# EAGLE schematic AVR_Tag-Connect (EAGLE 7.4.0)
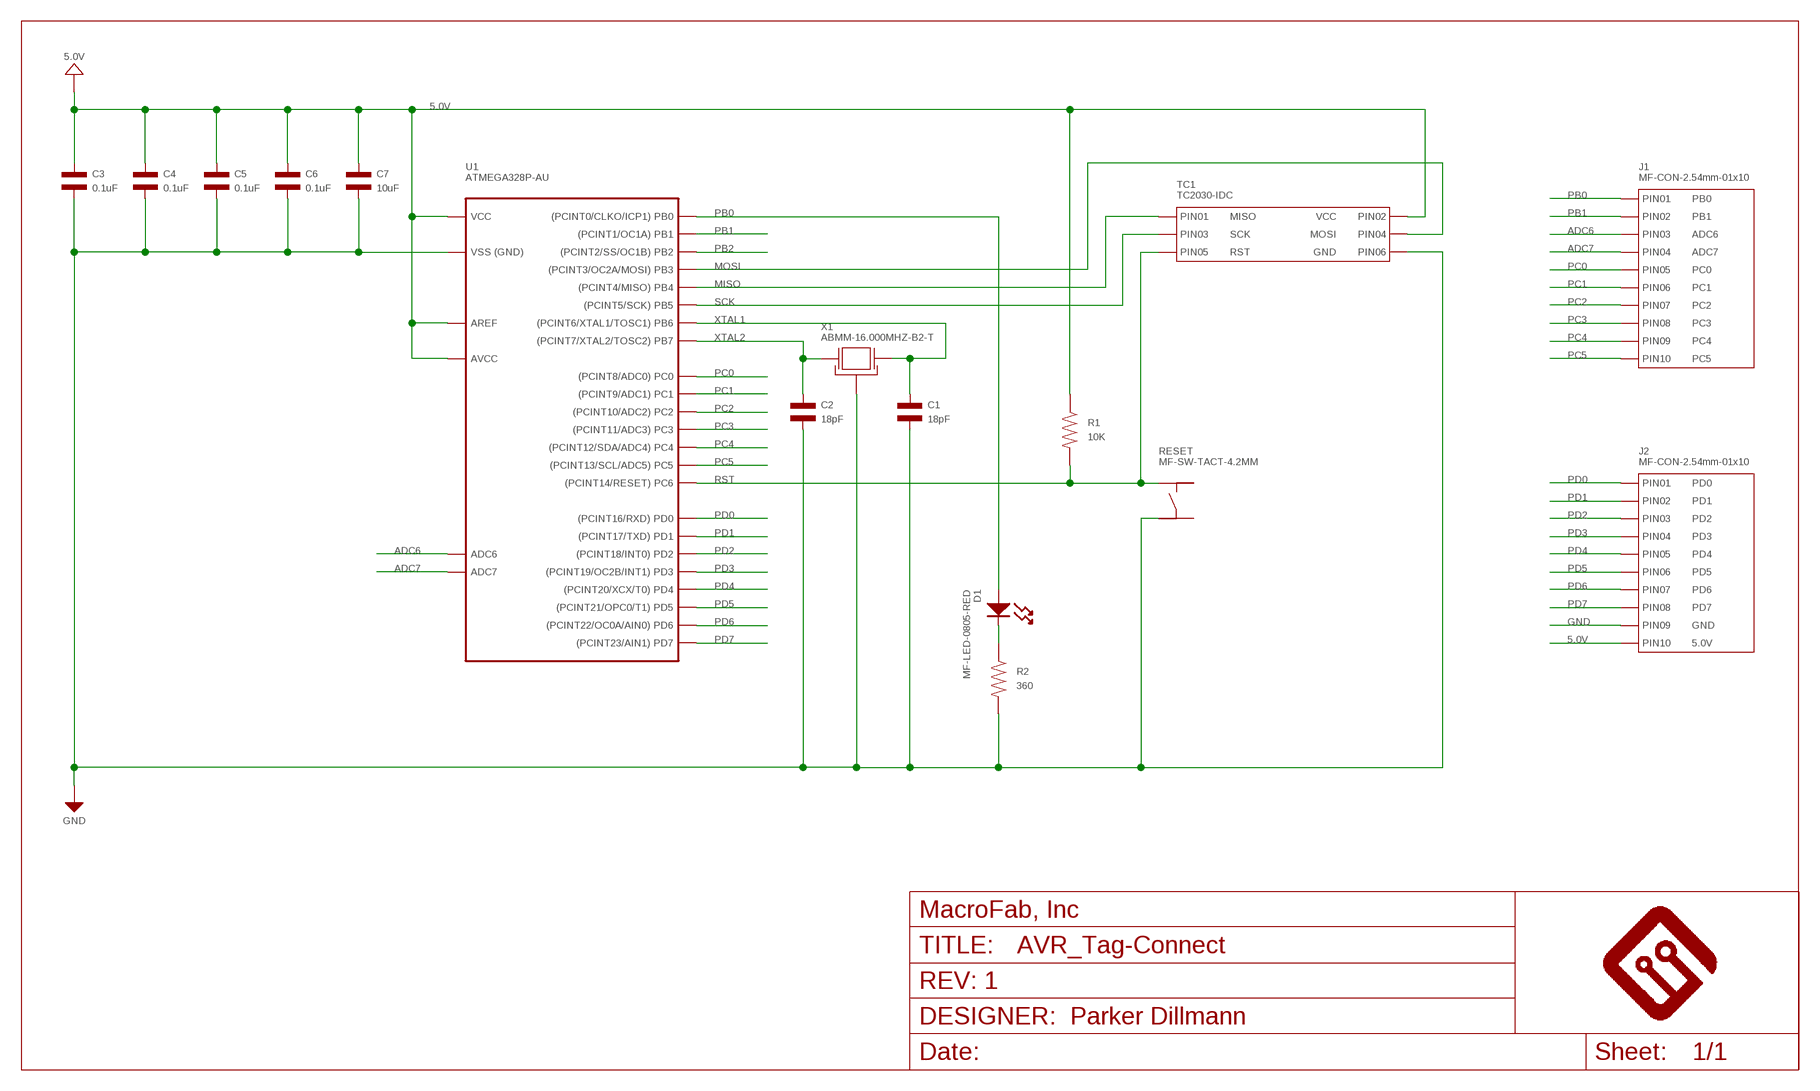
[diagram p0: schematic, sheet 1]

## Parts
C1  18pF  CAPACITOR_NP_0805  [C0805]
C2  18pF  CAPACITOR_NP_0805  [C0805]
C3  0.1uF  CAPACITOR_NP_0805  [C0805]
C4  0.1uF  CAPACITOR_NP_0805  [C0805]
C5  0.1uF  CAPACITOR_NP_0805  [C0805]
C6  0.1uF  CAPACITOR_NP_0805  [C0805]
C7  10uF  CAPACITOR_NP_1206  [C1206]
D1  MF-LED-0805-RED  LED_SINGLE-0805-RED  [LED0805]
FRAME1  MF_FRAMEDEFAULT  [MF_FRAME_DEFAULT]
J1  MF-CON-2.54mm-01x10  CON_01X10_PTH_2.54MM  [PTH_2.54MM_01X10]
J2  MF-CON-2.54mm-01x10  CON_01X10_PTH_2.54MM  [PTH_2.54MM_01X10]
R1  10K  RESISTOR_0805  [R0805]
R2  360  RESISTOR_0805  [R0805]
RESET  MF-SW-TACT-4.2MM  TACT_4.2MM  [TACT4.2MM]
TC1  TC2030-IDC  CON_02X03_AVRISP_TC2030-IDC  [TC2030-IDC-FP]
U1  ATMEGA328P-AU  [TQFP32]
X1  ABMM-16.000MHZ-B2-T  CYRSTAL_GND_ABMM  [7MMX5MM]

## Nets
5.0V: C3.P$1 C4.P$1 C5.P$1 C6.P$1 C7.P$1 J2.P$10(PIN10) R1.P$1 TC1.P$2(PIN2) U1.P$4(VCC) U1.P$6(VCC) U1.P$18(AVCC) U1.P$20(AREF)
ADC6: J1.P$3(PIN3) U1.P$19(ADC6)
ADC7: J1.P$4(PIN4) U1.P$22(ADC7)
GND: C1.P$2 C2.P$2 C3.P$2 C4.P$2 C5.P$2 C6.P$2 C7.P$2 J2.P$9(PIN9) R2.P$2 RESET.P$3 TC1.P$6(PIN6) U1.P$3(GND) U1.P$5(GND) U1.P$21(GND) X1.P$2(GND) X1.P$4(GND)
MISO: TC1.P$1(PIN1) U1.P$16(PB4)
MOSI: TC1.P$4(PIN4) U1.P$15(PB3)
N$2: D1.CATHODE R2.P$1
PB0: D1.ANODE J1.P$1(PIN1) U1.P$12(PB0)
PB1: J1.P$2(PIN2) U1.P$13(PB1)
PB2: U1.P$14(PB2)
PC0: J1.P$5(PIN5) U1.P$23(PC0)
PC1: J1.P$6(PIN6) U1.P$24(PC1)
PC2: J1.P$7(PIN7) U1.P$25(PC2)
PC3: J1.P$8(PIN8) U1.P$26(PC3)
PC4: J1.P$9(PIN9) U1.P$27(PC4)
PC5: J1.P$10(PIN10) U1.P$28(PC5)
PD0: J2.P$1(PIN1) U1.P$30(PD0)
PD1: J2.P$2(PIN2) U1.P$31(PD1)
PD2: J2.P$3(PIN3) U1.P$32(PD2)
PD3: J2.P$4(PIN4) U1.P$1(PD3)
PD4: J2.P$5(PIN5) U1.P$2(PD4)
PD5: J2.P$6(PIN6) U1.P$9(PD5)
PD6: J2.P$7(PIN7) U1.P$10(PD6)
PD7: J2.P$8(PIN8) U1.P$11(PD7)
RST: R1.P$2 RESET.P$1 TC1.P$5(PIN5) U1.P$29(PC6)
SCK: TC1.P$3(PIN3) U1.P$17(PB5)
XTAL1: C1.P$1 U1.P$7(PB6) X1.P$3(X1)
XTAL2: C2.P$1 U1.P$8(PB7) X1.P$1(X0)
Unconnected: RESET.P$2 RESET.P$4

## Library data of the parts
C1 C2 = MF_Passives:CAPACITOR_NP: Library: MF_Passives Description: Device for Non-Polarized Capacitors. Manufacture part number (MPN) can be added via Attributes. Check https://factory.macrofab.com/parts for the house parts list.; MPN: 08055A180JAT2A; POPULATE: 1
C3-C6 = MF_Passives:CAPACITOR_NP: Library: MF_Passives Description: Device for Non-Polarized Capacitors. Manufacture part number (MPN) can be added via Attributes. Check https://factory.macrofab.com/parts for the house parts list.; MPN: MF-CAP-0805-0.1uF; POPULATE: 1
C7 = MF_Passives:CAPACITOR_NP: Library: MF_Passives Description: Device for Non-Polarized Capacitors. Manufacture part number (MPN) can be added via Attributes. Check https://factory.macrofab.com/parts for the house parts list.; MPN: MF-CAP-1206-10uF; POPULATE: 1
D1 = MF_LEDs:LED_SINGLE: Library: MF_LEDs Description: Device for Single LED Packages. Manufacture part number (MFG#) can be added via Attributes.; HOUSEPART: YES; MPN: MF-LED-0805-RED; POPULATE: 1; URL: https://factory.macrofab.com/part/MF-LED-0805-RED
FRAME1 = MF_Aesthetics:MF_FRAME: Library: MF_Aesthetics Description: Frame for adding Meta Data to the PCB and Schematic.; DNAME: Parker Dillmann; HOUSEPART: 0; POPULATE: 0; REVNUM: REV: 1
J1 = MF_Connectors:CON_01X10: Library: MF_Connectors Description: Header Connector with 10 Positions and 01 Rows. Use the LABEL Attribute to label the pin on the schematic and PCB. You can remove the attributes on the PCB by using the SMASH function on the part and then deleting the text.; HOUSEPART: YES; LABEL01: PB0; LABEL02: PB1; LABEL03: ADC6; LABEL04: ADC7; LABEL05: PC0; LABEL06: PC1; LABEL07: PC2; LABEL08: PC3; LABEL09: PC4; LABEL10: PC5; MPN: MF-CON-2.54mm-01x10; POPULATE: 1; URL: https://factory.macrofab.com/part/MF-CON-2.54mm-01x10
J2 = MF_Connectors:CON_01X10: Library: MF_Connectors Description: Header Connector with 10 Positions and 01 Rows. Use the LABEL Attribute to label the pin on the schematic and PCB. You can remove the attributes on the PCB by using the SMASH function on the part and then deleting the text.; HOUSEPART: YES; LABEL01: PD0; LABEL02: PD1; LABEL03: PD2; LABEL04: PD3; LABEL05: PD4; LABEL06: PD5; LABEL07: PD6; LABEL08: PD7; LABEL09: GND; LABEL10: 5.0V; MPN: MF-CON-2.54mm-01x10; POPULATE: 1; URL: https://factory.macrofab.com/part/MF-CON-2.54mm-01x10
R1 = MF_Passives:RESISTOR: Library: MF_Passives Description: Device for Resistors. Manufacture part number (MPN), Voltage, Tolerance, and Wattage Rating can be added via Attributes. Check https://factory.macrofab.com/parts for the house parts list.; MPN: MF-RES-0805-10K; POPULATE: 1
R2 = MF_Passives:RESISTOR: Library: MF_Passives Description: Device for Resistors. Manufacture part number (MPN), Voltage, Tolerance, and Wattage Rating can be added via Attributes. Check https://factory.macrofab.com/parts for the house parts list.; MPN: MF-RES-0805-360; POPULATE: 1
RESET = MF_Switches:TACT: Library: MF_Switches Description: Device for Tact Switches. Manufacture part number (MFG#) can be added via Attributes.; HOUSEPART: YES; MPN: MF-SW-TACT-4.2MM; POPULATE: 1; URL: https://factory.macrofab.com/part/MF-SW-TACT-4.2MM
TC1 = MF_Connectors:CON_02X03: Library: MF_Connectors Description: Header Connector with 6 Positions and 02 Rows. Use the LABEL Attribute to label the pin on the schematic and PCB. You can remove the attributes on the PCB by using the SMASH function on the part and then deleting the text.; HOUSEPART: NO; LABEL01: MISO; LABEL02: VCC; LABEL03: SCK; LABEL04: MOSI; LABEL05: RST; LABEL06: GND; MPN: TC2030-IDC; POPULATE: 0; URL: http://www.tag-connect.com/AVRISP
U1 = MF_IC_Digital:ATMEGA328P: Manufacturer Part #: ATMEGA328P Manufacturer: Atmel Description: 8-bit Microcontrollers - MCU 32KB In-system Flash 20MHz 1.8V-5.5V; HOUSEPART: NO; MPN: ATMEGA328P-AU; POPULATE: 1; URL: http://www.atmel.com/devices/atmega328p.aspx
X1 = MF_Frequency_Control:CYRSTAL_GND: Library: MF_Frequency_Control Description: Device for two functional pin Cyrstal Oscillators and a ground.; HOUSEPART: NO; MPN: ABMM-16.000MHZ-B2-T; POPULATE: 1; URL: http://www.abracon.com/Resonators/ABMM.pdf